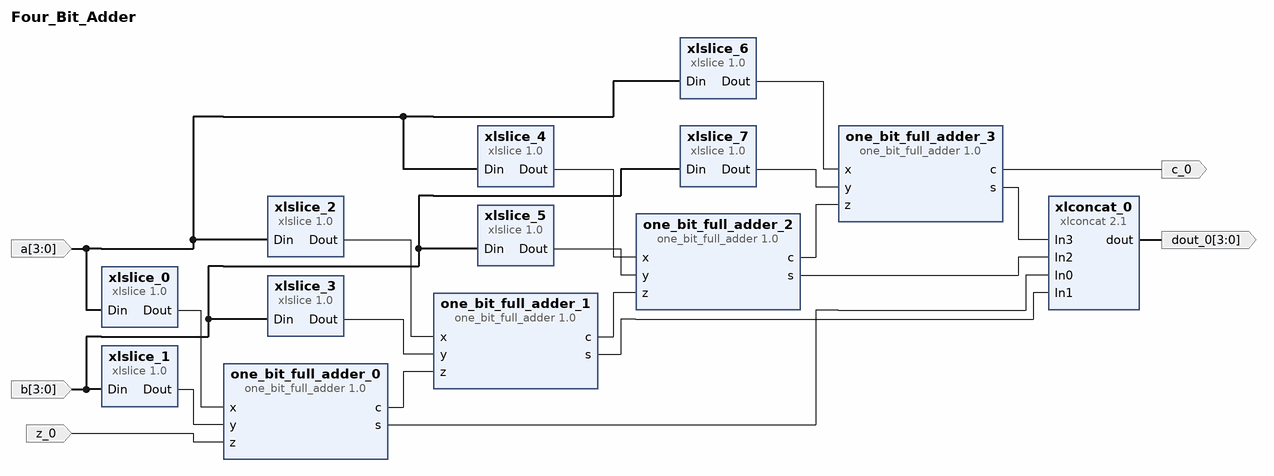
[diagram p0: block diagram of the top level]
# Vivado block design Four_Bit_Adder, xc7a35tcpg236-1, Vivado 2018.2
create_bd_design Four_Bit_Adder

create_bd_port -dir I -from 3 -to 0 a
create_bd_port -dir I -from 3 -to 0 b
create_bd_port -dir I z_0
create_bd_port -dir O c_0
create_bd_port -dir O -from 3 -to 0 dout_0

create_bd_cell -type ip -vlnv xilinx.com:user:one_bit_full_adder:1.0 one_bit_full_adder_0
create_bd_cell -type ip -vlnv xilinx.com:user:one_bit_full_adder:1.0 one_bit_full_adder_1
create_bd_cell -type ip -vlnv xilinx.com:user:one_bit_full_adder:1.0 one_bit_full_adder_2
create_bd_cell -type ip -vlnv xilinx.com:user:one_bit_full_adder:1.0 one_bit_full_adder_3
create_bd_cell -type ip -vlnv xilinx.com:ip:xlslice:1.0 xlslice_0
set_property -dict {CONFIG.DIN_TO 0 CONFIG.DIN_FROM 0 CONFIG.DIN_WIDTH 4} [get_bd_cells xlslice_0]
create_bd_cell -type ip -vlnv xilinx.com:ip:xlslice:1.0 xlslice_1
set_property -dict {CONFIG.DIN_TO 0 CONFIG.DIN_FROM 0 CONFIG.DIN_WIDTH 4} [get_bd_cells xlslice_1]
create_bd_cell -type ip -vlnv xilinx.com:ip:xlslice:1.0 xlslice_2
set_property -dict {CONFIG.DIN_TO 1 CONFIG.DIN_FROM 1 CONFIG.DIN_WIDTH 4 CONFIG.DOUT_WIDTH 1} [get_bd_cells xlslice_2]
create_bd_cell -type ip -vlnv xilinx.com:ip:xlslice:1.0 xlslice_3
set_property -dict {CONFIG.DIN_TO 1 CONFIG.DIN_FROM 1 CONFIG.DIN_WIDTH 4 CONFIG.DOUT_WIDTH 1} [get_bd_cells xlslice_3]
create_bd_cell -type ip -vlnv xilinx.com:ip:xlslice:1.0 xlslice_4
set_property -dict {CONFIG.DIN_TO 2 CONFIG.DIN_FROM 2 CONFIG.DIN_WIDTH 4 CONFIG.DOUT_WIDTH 1} [get_bd_cells xlslice_4]
create_bd_cell -type ip -vlnv xilinx.com:ip:xlslice:1.0 xlslice_5
set_property -dict {CONFIG.DIN_TO 2 CONFIG.DIN_FROM 2 CONFIG.DIN_WIDTH 4 CONFIG.DOUT_WIDTH 1} [get_bd_cells xlslice_5]
create_bd_cell -type ip -vlnv xilinx.com:ip:xlslice:1.0 xlslice_6
set_property -dict {CONFIG.DIN_TO 3 CONFIG.DIN_FROM 3 CONFIG.DIN_WIDTH 4 CONFIG.DOUT_WIDTH 1} [get_bd_cells xlslice_6]
create_bd_cell -type ip -vlnv xilinx.com:ip:xlslice:1.0 xlslice_7
set_property -dict {CONFIG.DIN_TO 3 CONFIG.DIN_FROM 3 CONFIG.DIN_WIDTH 4 CONFIG.DOUT_WIDTH 1} [get_bd_cells xlslice_7]
create_bd_cell -type ip -vlnv xilinx.com:ip:xlconcat:2.1 xlconcat_0
set_property -dict [list \
  CONFIG.NUM_PORTS 4 \
  CONFIG.IN0_WIDTH 1 \
  CONFIG.IN1_WIDTH 1 \
  CONFIG.IN2_WIDTH 1 \
  CONFIG.IN3_WIDTH 1 \
] [get_bd_cells xlconcat_0]

# ---- connections ----

connect_bd_net [get_bd_pins xlslice_0/Dout] [get_bd_pins one_bit_full_adder_0/x]
connect_bd_net [get_bd_ports a] [get_bd_pins xlslice_0/Din] [get_bd_pins xlslice_2/Din] [get_bd_pins xlslice_4/Din] [get_bd_pins xlslice_6/Din]
connect_bd_net [get_bd_ports b] [get_bd_pins xlslice_1/Din] [get_bd_pins xlslice_3/Din] [get_bd_pins xlslice_5/Din] [get_bd_pins xlslice_7/Din]
connect_bd_net [get_bd_pins xlslice_1/Dout] [get_bd_pins one_bit_full_adder_0/y]
connect_bd_net [get_bd_pins xlslice_2/Dout] [get_bd_pins one_bit_full_adder_1/x]
connect_bd_net [get_bd_pins xlslice_3/Dout] [get_bd_pins one_bit_full_adder_1/y]
connect_bd_net [get_bd_pins xlslice_4/Dout] [get_bd_pins one_bit_full_adder_2/x]
connect_bd_net [get_bd_pins xlslice_5/Dout] [get_bd_pins one_bit_full_adder_2/y]
connect_bd_net [get_bd_pins xlslice_6/Dout] [get_bd_pins one_bit_full_adder_3/x]
connect_bd_net [get_bd_pins xlslice_7/Dout] [get_bd_pins one_bit_full_adder_3/y]
connect_bd_net -net z_0_1 [get_bd_ports z_0] [get_bd_pins one_bit_full_adder_0/z]
connect_bd_net [get_bd_pins one_bit_full_adder_0/c] [get_bd_pins one_bit_full_adder_1/z]
connect_bd_net [get_bd_pins one_bit_full_adder_1/c] [get_bd_pins one_bit_full_adder_2/z]
connect_bd_net [get_bd_pins one_bit_full_adder_2/c] [get_bd_pins one_bit_full_adder_3/z]
connect_bd_net [get_bd_pins one_bit_full_adder_3/c] [get_bd_ports c_0]
connect_bd_net [get_bd_pins one_bit_full_adder_0/s] [get_bd_pins xlconcat_0/In0]
connect_bd_net [get_bd_pins one_bit_full_adder_1/s] [get_bd_pins xlconcat_0/In1]
connect_bd_net [get_bd_pins one_bit_full_adder_2/s] [get_bd_pins xlconcat_0/In2]
connect_bd_net [get_bd_pins one_bit_full_adder_3/s] [get_bd_pins xlconcat_0/In3]
connect_bd_net [get_bd_pins xlconcat_0/dout] [get_bd_ports dout_0]

validate_bd_design
save_bd_design
